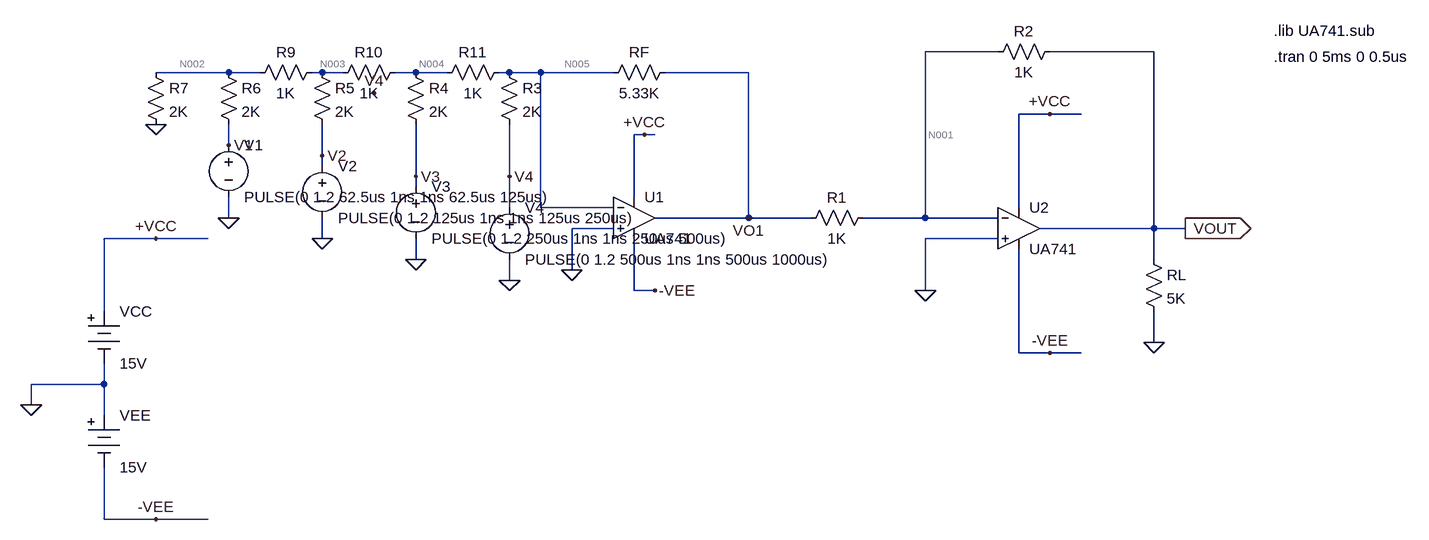
[diagram p0: schematic lab2-1.asc]
lab2-1.asc, the LTspice schematic file:
Version 4
SHEET 1 1628 724
WIRE 960 -64 848 -64
WIRE 1200 -64 1040 -64
WIRE -224 -32 -336 -32
WIRE -176 -32 -224 -32
WIRE -80 -32 -96 -32
WIRE -48 -32 -80 -32
WIRE 64 -32 32 -32
WIRE 112 -32 64 -32
WIRE 208 -32 192 -32
WIRE 256 -32 208 -32
WIRE 368 -32 256 -32
WIRE 576 -32 448 -32
WIRE 1040 32 992 32
WIRE 1088 32 1040 32
WIRE 416 64 400 64
WIRE 432 64 416 64
WIRE -224 80 -224 48
WIRE -80 96 -80 48
WIRE -80 112 -80 96
WIRE 64 128 64 48
WIRE 208 128 208 48
WIRE 64 144 64 128
WIRE 400 160 400 64
WIRE 208 176 208 128
WIRE 256 176 256 -32
WIRE 368 176 256 176
WIRE 992 176 992 32
WIRE -224 192 -224 160
WIRE 576 192 576 -32
WIRE 576 192 432 192
WIRE 672 192 576 192
WIRE 848 192 848 -64
WIRE 848 192 752 192
WIRE 960 192 848 192
WIRE 368 208 304 208
WIRE 1200 208 1200 -64
WIRE 1200 208 1024 208
WIRE 1248 208 1200 208
WIRE -336 224 -416 224
WIRE -256 224 -336 224
WIRE -80 224 -80 192
WIRE 960 224 848 224
WIRE 64 256 64 224
WIRE 1200 256 1200 208
WIRE 304 272 304 208
WIRE 208 288 208 256
WIRE 400 304 400 224
WIRE 432 304 400 304
WIRE 848 304 848 224
WIRE -416 336 -416 224
WIRE 1200 384 1200 336
WIRE 992 400 992 240
WIRE 1040 400 992 400
WIRE 1088 400 1040 400
WIRE -416 448 -416 416
WIRE -416 448 -528 448
WIRE -528 480 -528 448
WIRE -416 496 -416 448
WIRE -416 656 -416 576
WIRE -336 656 -416 656
WIRE -256 656 -336 656
FLAG 1248 208 VOUT
IOPIN 1248 208 Out
FLAG -528 480 0
FLAG -336 224 +VCC
FLAG 1040 32 +VCC
FLAG -336 656 -VEE
FLAG 1040 400 -VEE
FLAG 1200 384 0
FLAG 848 304 0
FLAG 416 64 +VCC
FLAG 432 304 -VEE
FLAG 576 192 VO1
FLAG 304 272 0
FLAG -336 48 0
FLAG -224 192 0
FLAG -80 224 0
FLAG 64 256 0
FLAG 208 288 0
FLAG -224 80 V1
FLAG -80 96 V2
FLAG 64 128 V3
FLAG 208 128 V4
FLAG 0 0 V4
SYMBOL Opamps\\opamp2 992 144 R0
SYMATTR InstName U2
SYMATTR Value UA741
SYMBOL res 1184 240 R0
SYMATTR InstName RL
SYMATTR Value 5K
SYMBOL Misc\\battery -416 320 R0
SYMATTR InstName VCC
SYMATTR Value 15V
SYMBOL Misc\\battery -416 480 R0
SYMATTR InstName VEE
SYMATTR Value 15V
SYMBOL res 768 176 R90
WINDOW 0 0 56 VBottom 2
WINDOW 3 32 56 VTop 2
SYMATTR InstName R1
SYMATTR Value 1K
SYMBOL res 1056 -80 R90
WINDOW 0 0 56 VBottom 2
WINDOW 3 32 56 VTop 2
SYMATTR InstName R2
SYMATTR Value 1K
SYMBOL Opamps\\opamp2 400 128 R0
SYMATTR InstName U1
SYMATTR Value UA741
SYMBOL res 464 -48 R90
WINDOW 0 0 56 VBottom 2
WINDOW 3 32 56 VTop 2
SYMATTR InstName RF
SYMATTR Value 5.33K
SYMBOL res 192 -48 R0
SYMATTR InstName R3
SYMATTR Value 2K
SYMBOL res 48 -48 R0
SYMATTR InstName R4
SYMATTR Value 2K
SYMBOL res -96 -48 R0
SYMATTR InstName R5
SYMATTR Value 2K
SYMBOL res -352 -48 R0
SYMATTR InstName R7
SYMATTR Value 2K
SYMBOL res -80 -48 R90
WINDOW 0 0 56 VBottom 2
WINDOW 3 32 56 VTop 2
SYMATTR InstName R9
SYMATTR Value 1K
SYMBOL res 48 -48 R90
WINDOW 0 0 56 VBottom 2
WINDOW 3 32 56 VTop 2
SYMATTR InstName R10
SYMATTR Value 1K
SYMBOL res 208 -48 R90
WINDOW 0 0 56 VBottom 2
WINDOW 3 32 56 VTop 2
SYMATTR InstName R11
SYMATTR Value 1K
SYMBOL res -240 -48 R0
SYMATTR InstName R6
SYMATTR Value 2K
SYMBOL voltage -224 64 R0
WINDOW 123 0 0 Left 2
WINDOW 39 0 0 Left 2
SYMATTR InstName V1
SYMATTR Value PULSE(0 1.2 62.5us 1ns 1ns 62.5us 125us)
SYMBOL voltage -80 96 R0
WINDOW 123 0 0 Left 2
WINDOW 39 0 0 Left 2
SYMATTR InstName V2
SYMATTR Value PULSE(0 1.2 125us 1ns 1ns 125us 250us)
SYMBOL voltage 64 128 R0
WINDOW 123 0 0 Left 2
WINDOW 39 0 0 Left 2
SYMATTR InstName V3
SYMATTR Value PULSE(0 1.2 250us 1ns 1ns 250us 500us)
SYMBOL voltage 208 160 R0
WINDOW 123 0 0 Left 2
WINDOW 39 0 0 Left 2
SYMATTR InstName V4
SYMATTR Value PULSE(0 1.2 500us 1ns 1ns 500us 1000us)
TEXT 1384 -96 Left 2 !.lib UA741.sub
TEXT 1384 -56 Left 2 !.tran 0 5ms 0 0.5us

The netlist it stands for:
* lab2-1.asc
XU2 0 N001 +VCC -VEE VOUT UA741  ; pins In+ In- V+ V- OUT
RL VOUT 0 5K
VCC +VCC 0 15V
VEE 0 -VEE 15V
R1 N001 VO1 1K
R2 VOUT N001 1K
XU1 0 N005 +VCC -VEE VO1 UA741  ; pins In+ In- V+ V- OUT
RF VO1 N005 5.33K
R3 N005 V4 2K
R4 N004 V3 2K
R5 N003 V2 2K
R7 N002 0 2K
R9 N003 N002 1K
R10 N004 N003 1K
R11 N005 N004 1K
R6 N002 V1 2K
V1 V1 0 PULSE(0 1.2 62.5us 1ns 1ns 62.5us 125us)
V2 V2 0 PULSE(0 1.2 125us 1ns 1ns 125us 250us)
V3 V3 0 PULSE(0 1.2 250us 1ns 1ns 250us 500us)
V4 V4 0 PULSE(0 1.2 500us 1ns 1ns 500us 1000us)
.lib UA741.sub
.tran 0 5ms 0 0.5us
.backanno
.end

* Results of the author's LTspice run, read from the files saved beside the schematic
* Operating Point, zero values left out:
*   V(vout) = -393.8 µV
*   V(-vee) = -15 V
*   V(+vcc) = 15 V
*   V(n001) = 11.19 µV
*   V(vo1) = 495.9 µV
*   V(n005) = 11.18 µV
*   V(n004) = 5.591 µV
*   V(n003) = 2.795 µV
*   V(n002) = 1.398 µV
*   I(R6) = 698.9 pA
*   I(R11) = 5.591 nA
*   I(R10) = 2.795 nA
*   I(R9) = 1.398 nA
*   I(R7) = 698.9 pA
*   I(R5) = 1.398 nA
*   I(R4) = 2.795 nA
*   I(R3) = 5.591 nA
*   I(Rf) = 90.94 nA
*   I(R2) = -404.9 nA
*   I(R1) = -484.7 nA
*   I(Rl) = -78.75 nA
*   I(V4) = 5.591 nA
*   I(V3) = 2.795 nA
*   I(V2) = 1.398 nA
*   I(V1) = 698.9 pA
*   I(Vee) = -3.333 mA
*   I(Vcc) = -3.333 mA
*   Ix(u2:1) = 79.74 nA
*   Ix(u2:2) = 79.76 nA
*   Ix(u2:3) = 1.667 mA
*   Ix(u2:4) = -1.667 mA
*   Ix(u2:5) = 483.7 nA
*   Ix(u1:1) = 79.74 nA
*   Ix(u1:2) = 79.76 nA
*   Ix(u1:3) = 1.667 mA
*   Ix(u1:4) = -1.667 mA
*   Ix(u1:5) = -575.6 nA
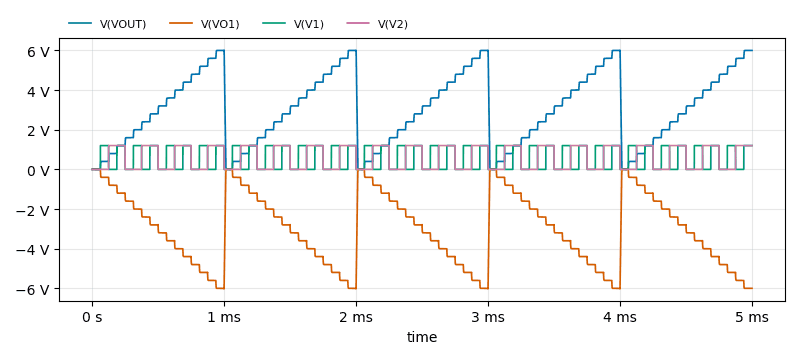
[diagram p1: Transient Analysis of lab2-1.asc, plotted from the saved traces]
* Transient Analysis, 1 run:
*   V(VOUT): min -1.02 mV, max 6 V, average 3.023 V, rms 3.531 V, last 5.996 V
*   V(VO1): min -6.02 V, max 2.119 mV, average -3.022 V, rms 3.531 V, last -5.996 V
*   V(V1): min 0 V, max 1.2 V, average 600 mV, rms 848.5 mV, last 1.2 V
*   V(V2): min 0 V, max 1.2 V, average 600 mV, rms 848.5 mV, last 1.2 V